# EAGLE schematic TINRS - Looper (EAGLE 7.7.0)

## Sheet 1 of 5: MCU & Eeprom
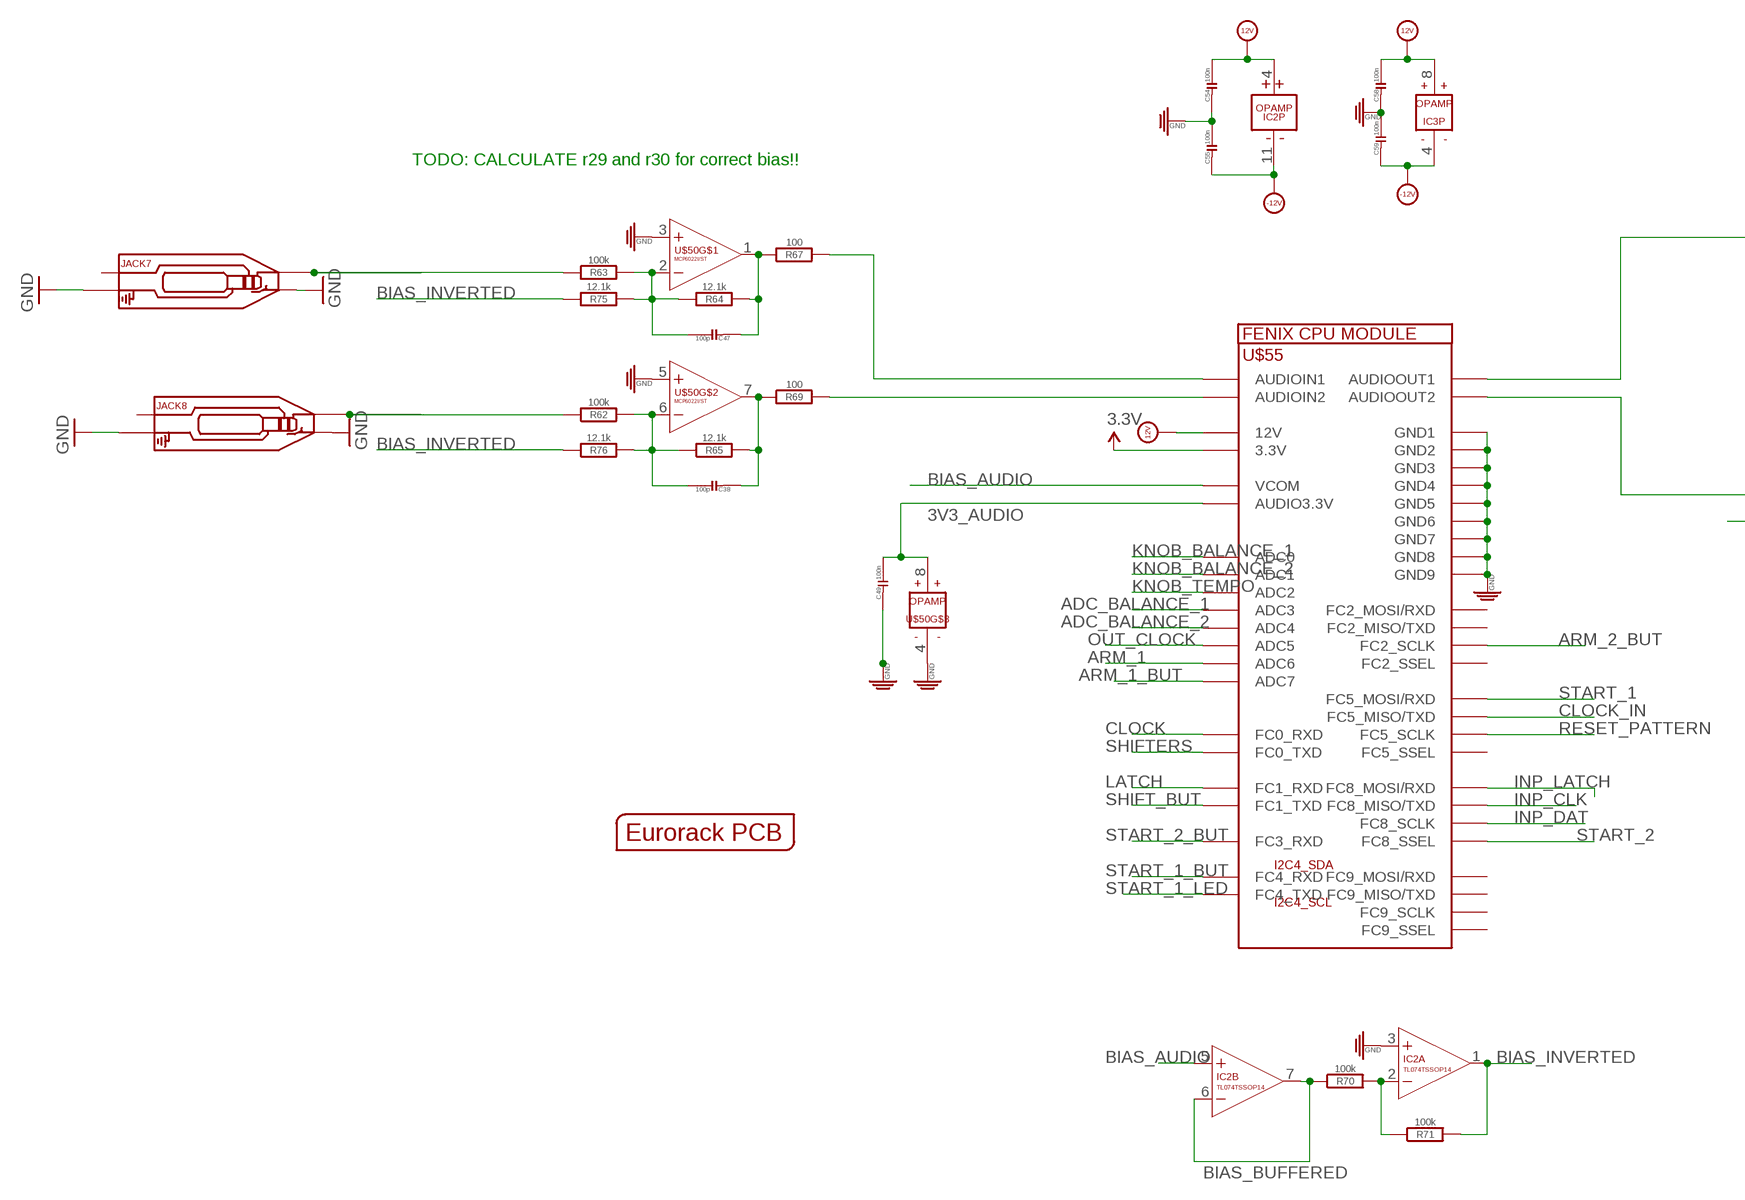
[diagram p0: schematic, sheet 1, part 1 of 2]
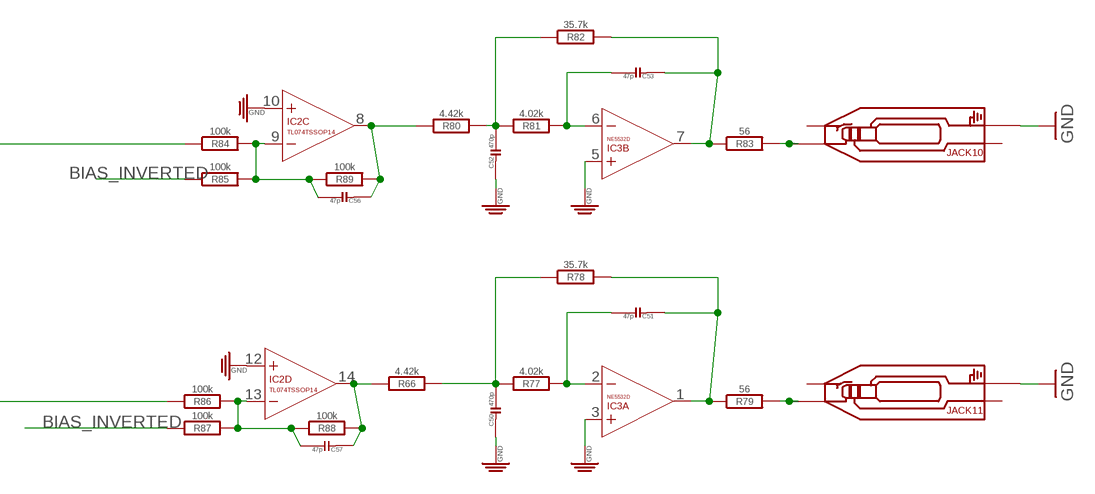
[diagram p1: schematic, sheet 1, part 2 of 2]

### Parts
C38  100p  C-0603  [C0603]
C47  100p  C-0603  [C0603]
C49  100n  C-0603  [C0603]
C50  470p  C-0603  [C0603]
C51  47p  C-0603  [C0603]
C52  470p  C-0603  [C0603]
C53  47p  C-0603  [C0603]
C54  100n  C-0603  [C0603]
C55  100n  C-0603  [C0603]
C56  47p  C-0603  [C0603]
C57  47p  C-0603  [C0603]
C58  100n  C-0603  [C0603]
C59  100n  C-0603  [C0603]
IC2  TL074TSSOP14  [TSSOP14]
IC3  NE5532D  [SO08]
JACK7  AUDIO-JACK_SMALLSYMBOL  [3.5MM-JACK-SWITCH-13MM-NOHOLES-TESTPAD]
JACK8  AUDIO-JACK_SMALLSYMBOL  [3.5MM-JACK-SWITCH-13MM-NOHOLES-TESTPAD]
JACK10  AUDIO-JACK_SMALLSYMBOL  [3.5MM-JACK-SWITCH-13MM-NOHOLES-TESTPAD]
JACK11  AUDIO-JACK_SMALLSYMBOL  [3.5MM-JACK-SWITCH-13MM-NOHOLES-TESTPAD]
OUTLINE  EURORACK_PCB12HP  [EURORACK12HPPCB]
R62  100k  R-EU_R0402  [R0402]
R63  100k  R-EU_R0402  [R0402]
R64  12.1k  R-EU_R0402  [R0402]
R65  12.1k  R-EU_R0402  [R0402]
R66  4.42k  R-EU_R0402  [R0402]
R67  100  R-EU_R0402  [R0402]
R69  100  R-EU_R0402  [R0402]
R70  100k  R-EU_R0402  [R0402]
R71  100k  R-EU_R0402  [R0402]
R75  12.1k  R-EU_R0402  [R0402]
R76  12.1k  R-EU_R0402  [R0402]
R77  4.02k  R-EU_R0402  [R0402]
R78  35.7k  R-EU_R0402  [R0402]
R79  56  R-EU_R0402  [R0402]
R80  4.42k  R-EU_R0402  [R0402]
R81  4.02k  R-EU_R0402  [R0402]
R82  35.7k  R-EU_R0402  [R0402]
R83  56  R-EU_R0402  [R0402]
R84  100k  R-EU_R0402  [R0402]
R85  100k  R-EU_R0402  [R0402]
R86  100k  R-EU_R0402  [R0402]
R87  100k  R-EU_R0402  [R0402]
R88  100k  R-EU_R0402  [R0402]
R89  100k  R-EU_R0402  [R0402]
U$50  MCP6022I/ST  [TSSOP8]
U$55  MCUPLUGIN2  [MCUPLUGIN]

### Nets
3.3V: U$55.P$7(3.3V) ; also sheet 2,4,5
3V3_AUDIO [heavypower]: C49.2 U$50.8(V+) U$55.P$48(AUDIO3.3V)
12V [heavypower]: C54.2 C58.2 IC2.4(P:V+) IC3.8(P:V+) U$55.P$45(12V) ; also sheet 2,4
-12V [heavypower]: C55.1 C59.1 IC2.11(P:V-) IC3.4(P:V-) ; also sheet 4
ADC_BALANCE_1: U$55.P$28(ADC3) ; also sheet 5
ADC_BALANCE_2: U$55.P$29(ADC4) ; also sheet 5
ARM_1: U$55.P$31(ADC6) ; also sheet 5
ARM_1_BUT: U$55.P$32(ADC7) ; also sheet 2
ARM_2_BUT: U$55.P$11(FC2_SCLK) ; also sheet 2
BIAS_AUDIO: IC2.5(B:+IN) U$55.P$47(VCOM)
BIAS_BUFFERED: IC2.6(B:-IN) IC2.7(B:OUT) R70.1
BIAS_INVERTED: IC2.1(A:OUT) R71.2 R75.1 R76.1 R85.1 R87.1
CLOCK: U$55.P$36(FC0_RXD) ; also sheet 2
CLOCK_IN: U$55.P$21(FC5_MISO/TXD) ; also sheet 5
GND: C49.1 C50.1 C52.1 C54.1 C55.2 C58.1 C59.2 IC2.3(A:+IN) IC2.10(C:+IN) IC2.12(D:+IN) IC3.3(A:+IN) IC3.5(B:+IN) JACK7.RING_B@1(RING) JACK7.RING_T@3(RING) JACK7.SWITCH_B@1(SWITCH) JACK7.SWITCH_T@3(SWITCH) JACK8.RING_B@1(RING) JACK8.RING_T@3(RING) JACK8.SWITCH_B@1(SWITCH) JACK8.SWITCH_T@3(SWITCH) JACK10.RING_B@1(RING) JACK10.RING_T@3(RING) JACK11.RING_B@1(RING) JACK11.RING_T@3(RING) U$50.3(+IN) U$50.4(V-) U$50.5(+IN) U$55.P$1(GND1) U$55.P$6(GND2) U$55.P$8(GND3) U$55.P$23(GND4) U$55.P$24(GND5) U$55.P$33(GND6) U$55.P$39(GND7) U$55.P$40(GND8) U$55.P$46(GND9) ; also sheet 2,4,5
INP_CLK: U$55.P$13(FC8_MISO/TXD) ; also sheet 2
INP_DAT: U$55.P$15(FC8_SCLK) ; also sheet 2
INP_LATCH: U$55.P$14(FC8_MOSI/RXD) ; also sheet 2
KNOB_BALANCE_1: U$55.P$25(ADC0) ; also sheet 5
KNOB_BALANCE_2: U$55.P$26(ADC1) ; also sheet 5
KNOB_TEMPO: U$55.P$27(ADC2) ; also sheet 5
LATCH: U$55.P$38(FC1_RXD) ; also sheet 2
N$75: C38.2 R62.2 R65.1 R76.2 U$50.6(-IN)
N$77: C47.2 R63.2 R64.1 R75.2 U$50.2(-IN)
N$78: C38.1 R65.2 R69.1 U$50.7(OUT)
N$79: C47.1 R64.2 R67.1 U$50.1(OUT)
N$83: IC2.2(A:-IN) R70.2 R71.1
N$84: C51.2 IC3.2(A:-IN) R77.2
N$85: C50.2 R66.2 R77.1 R78.1
N$88: C51.1 IC3.1(A:OUT) R78.2 R79.1
N$89: JACK11.TIP_B@1(TIP) JACK11.TIP_T@3(TIP) R79.2
N$90: C53.2 IC3.6(B:-IN) R81.2
N$91: C52.2 R80.2 R81.1 R82.1
N$92: C53.1 IC3.7(B:OUT) R82.2 R83.1
N$94: JACK10.TIP_B@1(TIP) JACK10.TIP_T@3(TIP) R83.2
N$101: C56.2 IC2.9(C:-IN) R84.2 R85.2 R89.1
N$102: C57.2 IC2.13(D:-IN) R86.2 R87.2 R88.1
N$103: C56.1 IC2.8(C:OUT) R80.1 R89.2
N$104: R86.1 U$55.P$44(AUDIOOUT2)
N$105: R84.1 U$55.P$42(AUDIOOUT1)
N$106: C57.1 IC2.14(D:OUT) R66.1 R88.2
N$107: JACK7.TIP_B@1(TIP) JACK7.TIP_T@3(TIP) R63.1
N$108: JACK8.TIP_B@1(TIP) JACK8.TIP_T@3(TIP) R62.1
OUT_CLOCK: U$55.P$30(ADC5) ; also sheet 2
RESET_PATTERN: U$55.P$20(FC5_SCLK) ; also sheet 5
SHIFT_BUT: U$55.P$37(FC1_TXD) ; also sheet 2
SHIFTERS: U$55.P$35(FC0_TXD) ; also sheet 2
START_1: U$55.P$22(FC5_MOSI/RXD) ; also sheet 5
START_1_BUT: U$55.P$18(FC4_RXD) ; also sheet 2
START_1_LED: U$55.P$17(FC4_TXD) ; also sheet 2
START_2: U$55.P$16(FC8_SSEL) ; also sheet 5
START_2_BUT: U$55.P$34(FC3_RXD) ; also sheet 2
TO_AUDIOIN_1: R67.2 U$55.P$41(AUDIOIN1)
TO_AUDIOIN_2: R69.2 U$55.P$43(AUDIOIN2)
Unconnected: JACK7.SECOND_B@1(SECOND) JACK7.SECOND_T@3(SECOND) JACK8.SECOND_B@1(SECOND) JACK8.SECOND_T@3(SECOND) JACK10.SECOND_B@1(SECOND) JACK10.SECOND_T@3(SECOND) JACK10.SWITCH_B@1(SWITCH) JACK10.SWITCH_T@3(SWITCH) JACK11.SECOND_B@1(SECOND) JACK11.SECOND_T@3(SECOND) JACK11.SWITCH_B@1(SWITCH) JACK11.SWITCH_T@3(SWITCH) U$55.P$2(FC9_MOSI/RXD) U$55.P$3(FC9_MISO/TXD) U$55.P$4(FC9_SCLK) U$55.P$5(FC9_SSEL) U$55.P$9(FC2_MOSI/RXD) U$55.P$10(FC2_MISO/TXD) U$55.P$12(FC2_SSEL) U$55.P$19(FC5_SSEL)

### Notes on the sheet
- TODO: CALCULATE r29 and r30 for correct bias!!

## Sheet 2 of 5: LEDs & button
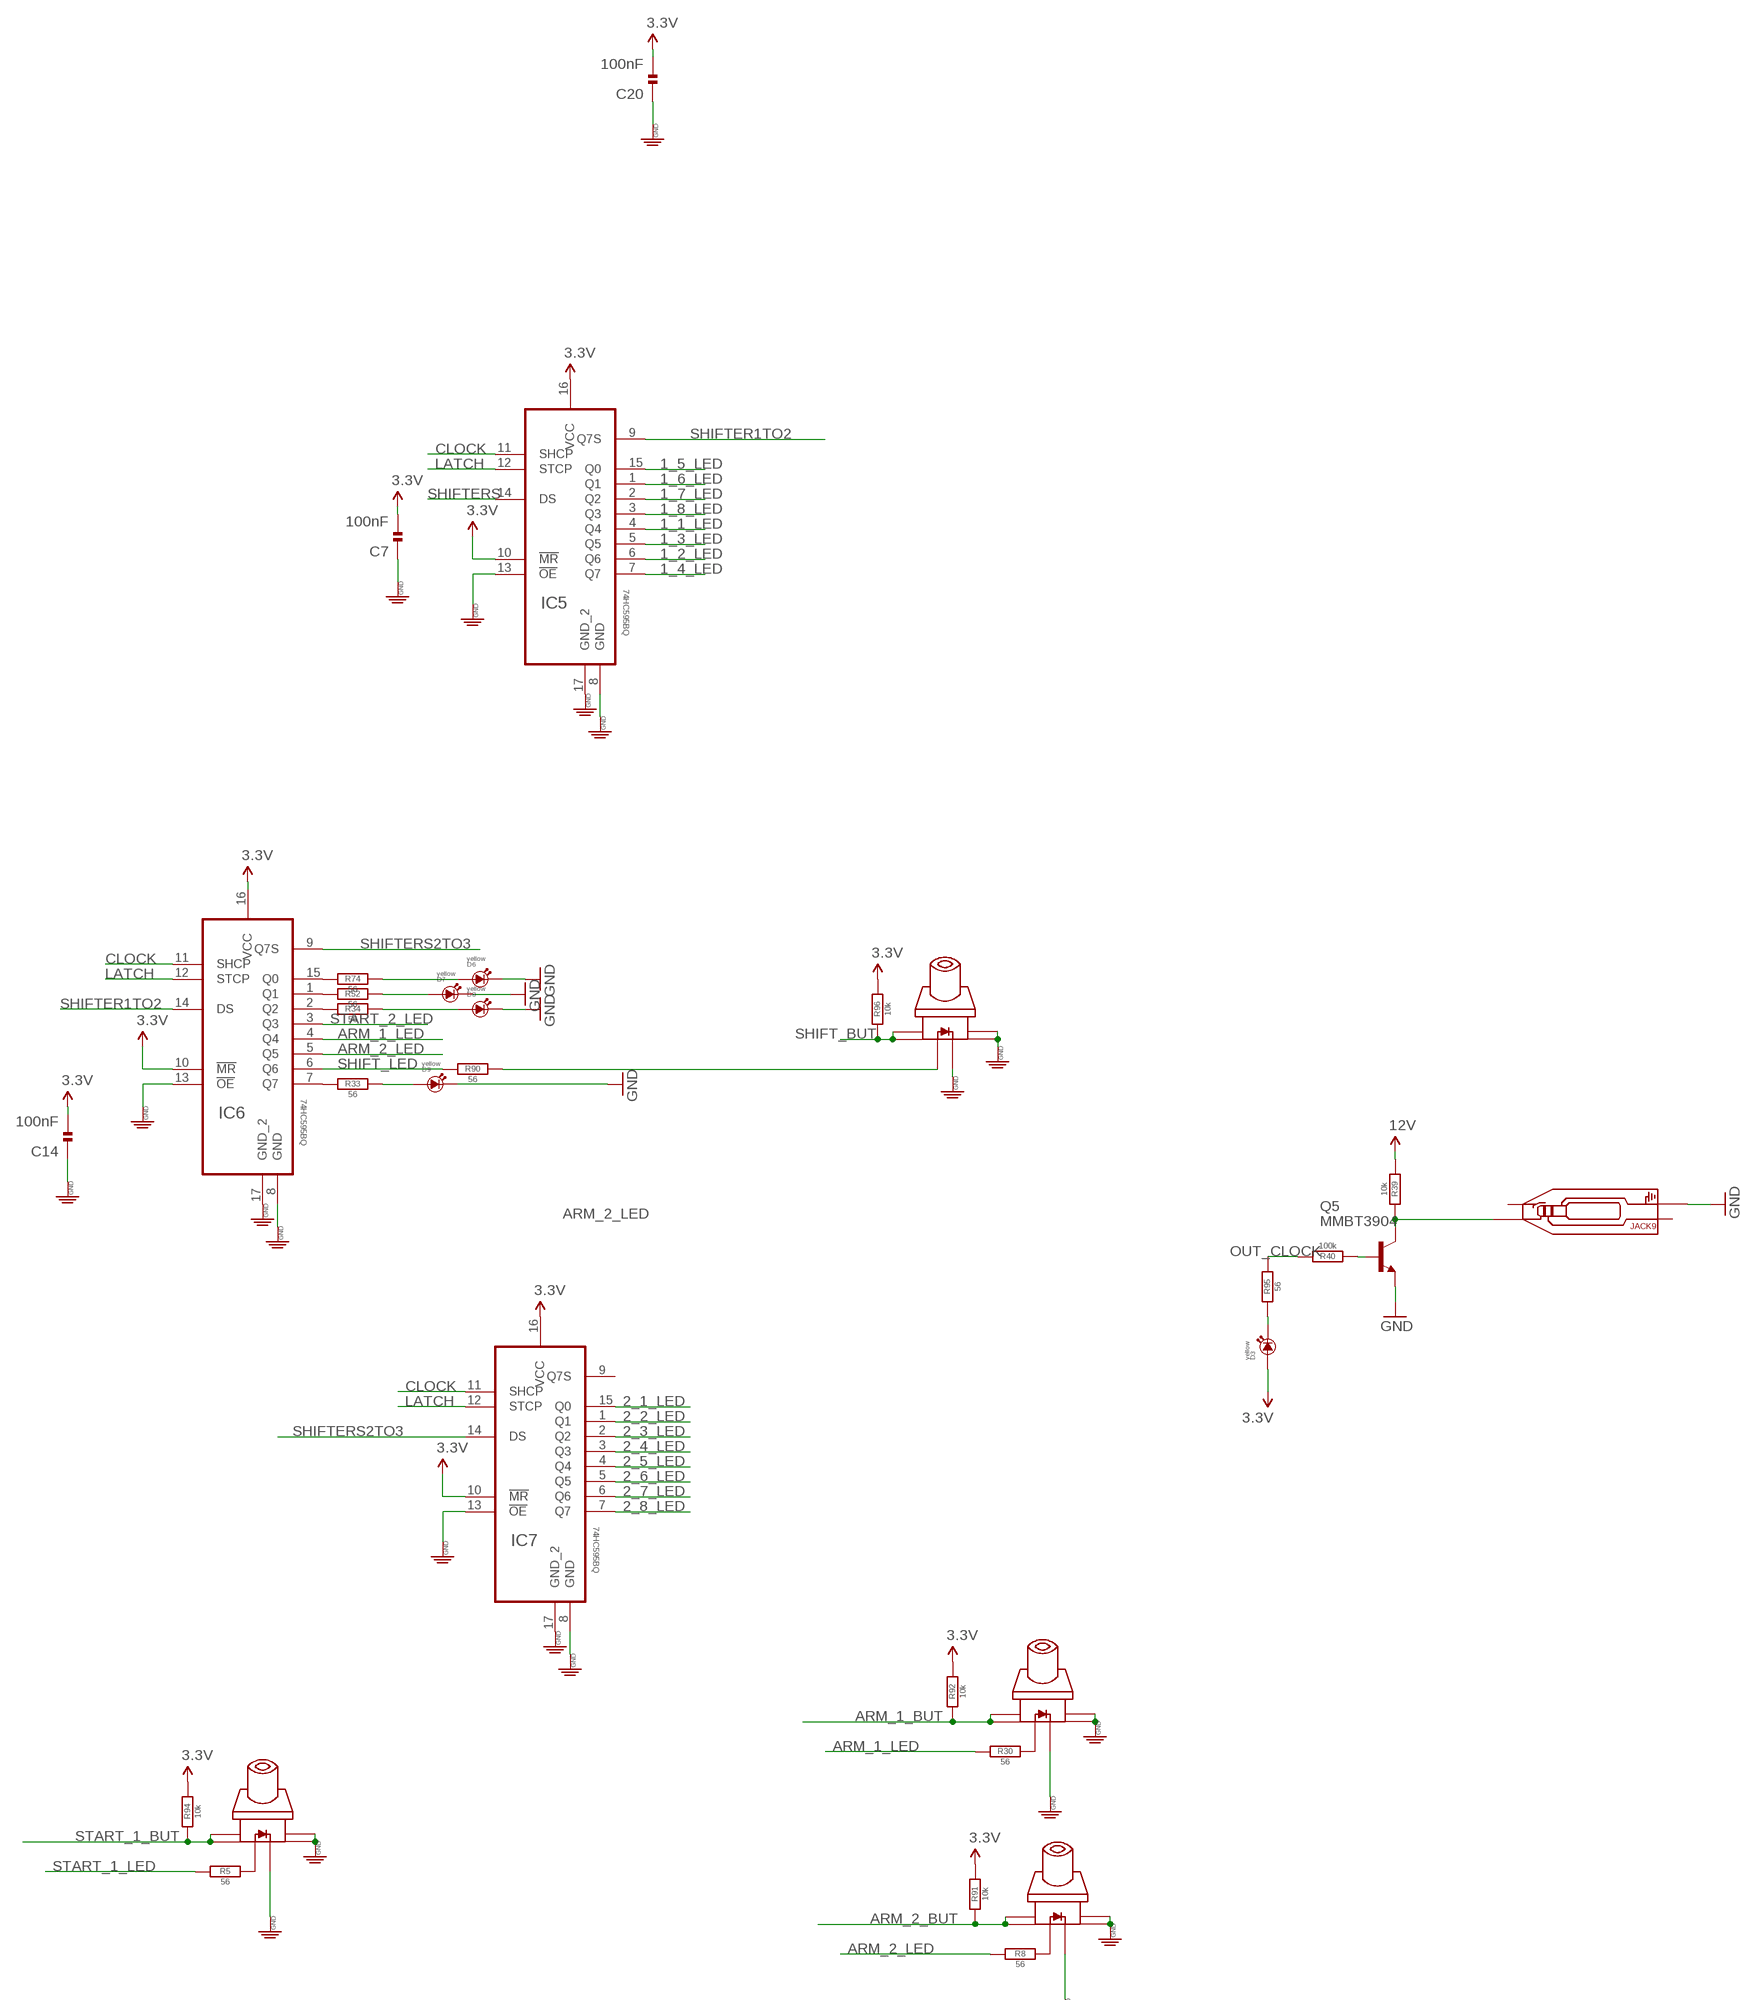
[diagram p2: schematic, sheet 2, part 1 of 3]
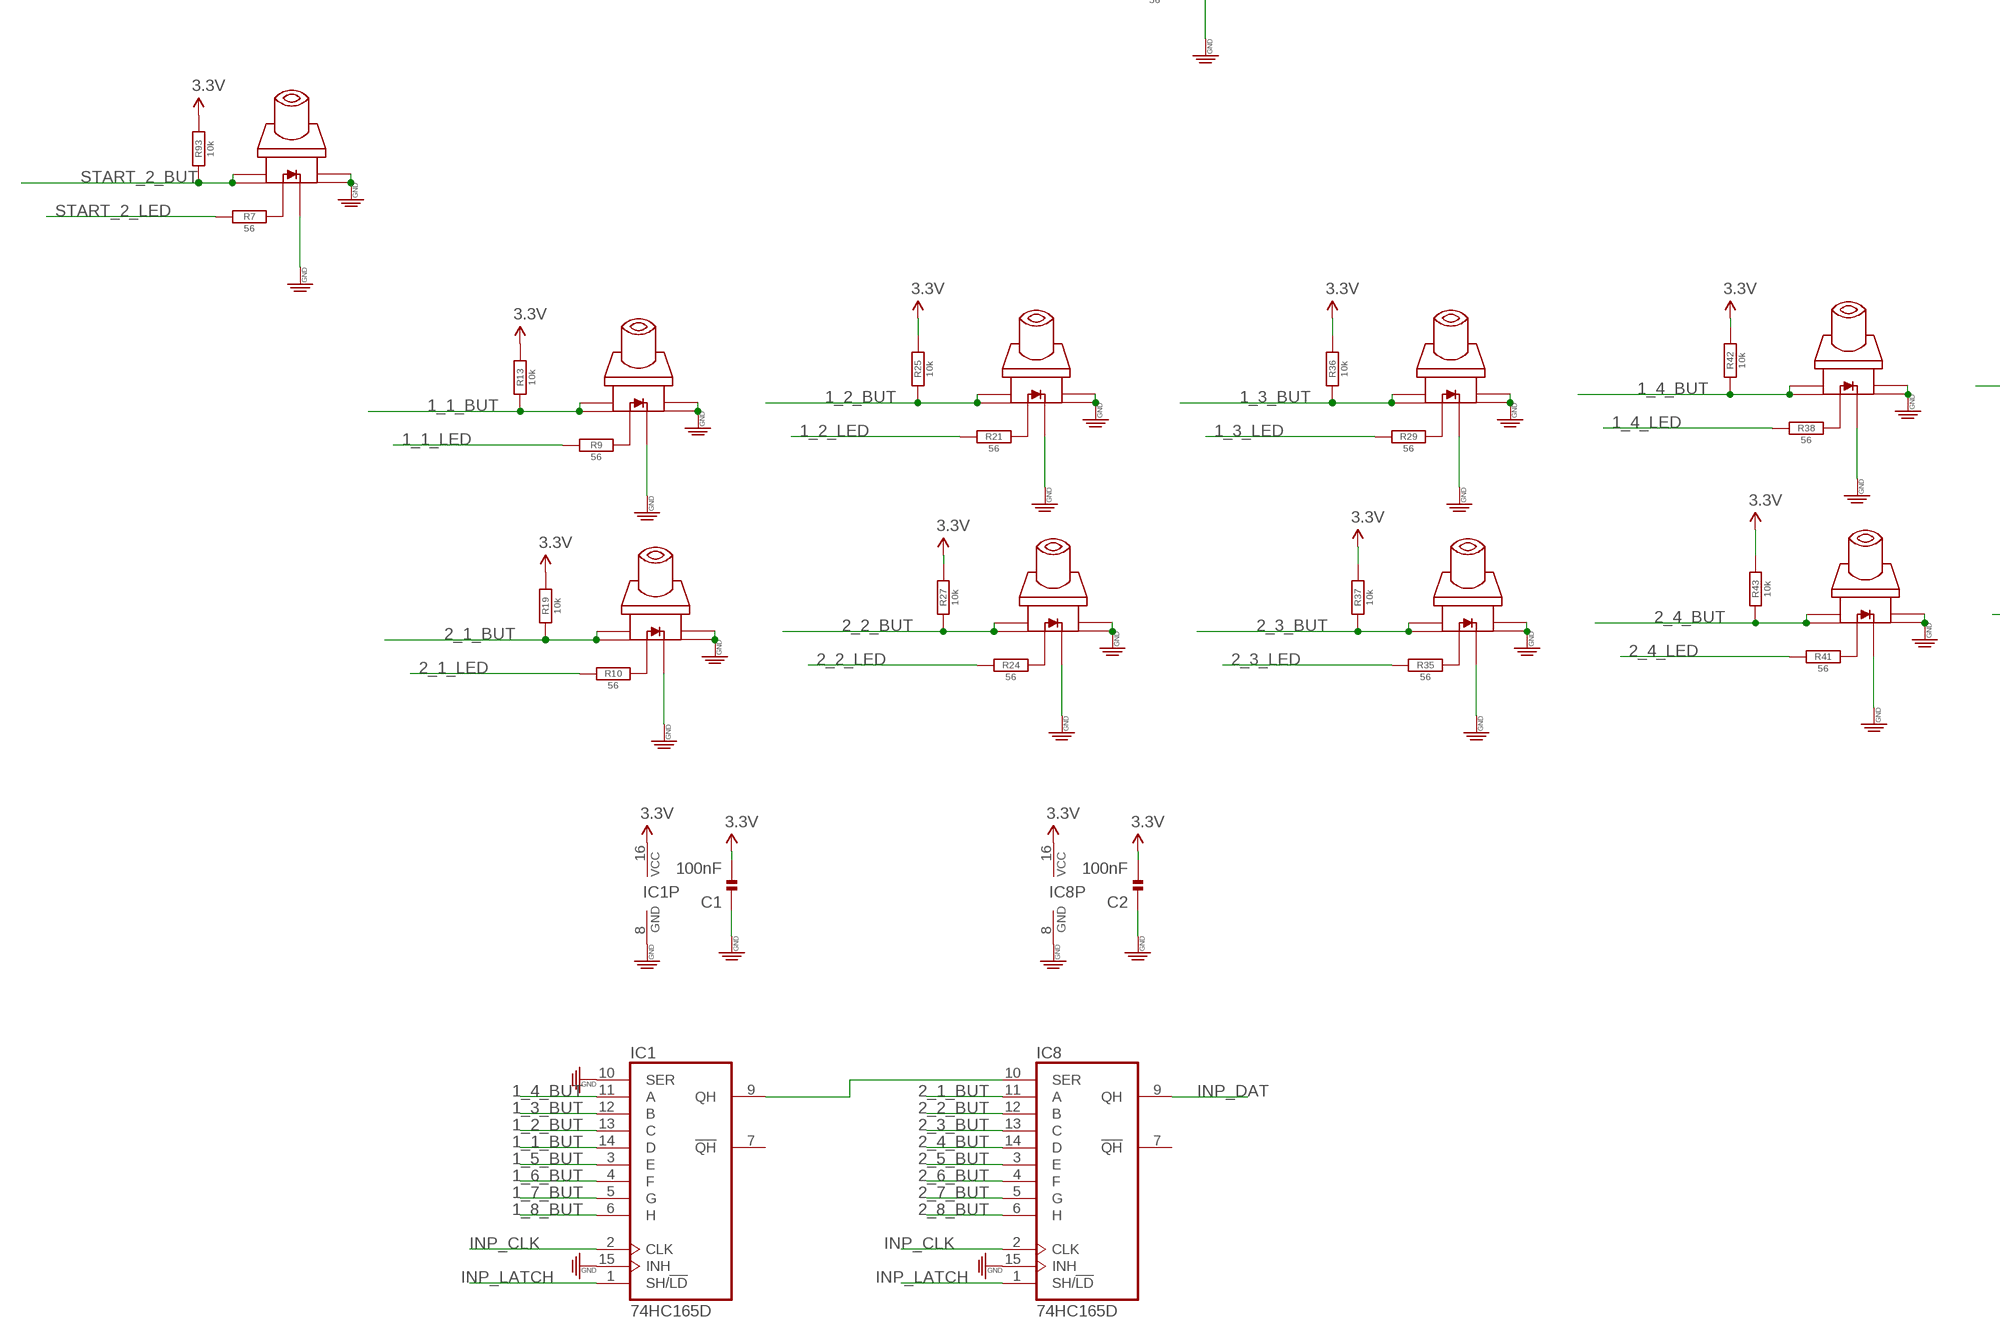
[diagram p3: schematic, sheet 2, part 2 of 3]
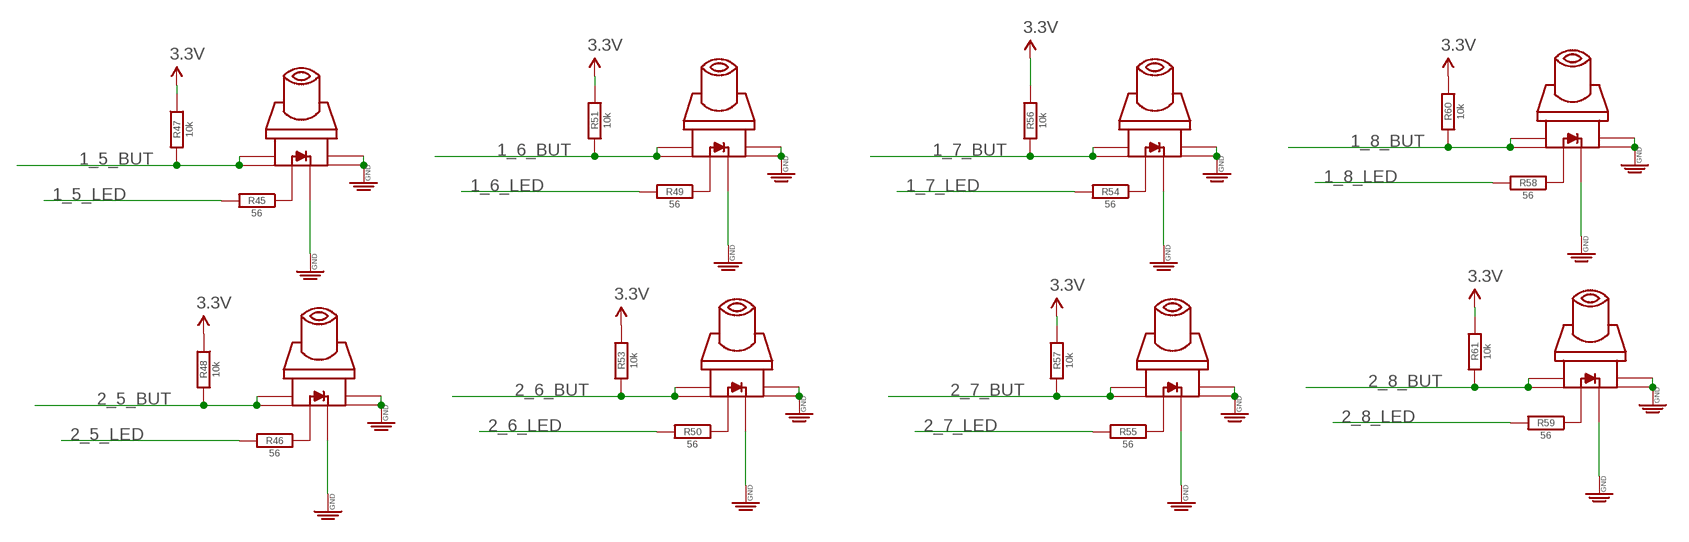
[diagram p4: schematic, sheet 2, part 3 of 3]

### Parts
C1  100nF  C-EUC0402  [C0402]
C2  100nF  C-EUC0402  [C0402]
C7  100nF  C-EUC0402  [C0402]
C14  100nF  C-EUC0402  [C0402]
C20  100nF  C-EUC0402  [C0402]
D3  yellow  LED3MM  [3MMLED]
D6  yellow  LED3MM  [3MMLED]
D7  yellow  LED3MM  [3MMLED]
D8  yellow  LED3MM  [3MMLED]
D9  yellow  LED3MM  [3MMLED]
IC1  74HC165D  [SO16]
IC5  74HC595BQ  [QFN50P250X350X100-17N]
IC6  74HC595BQ  [QFN50P250X350X100-17N]
IC7  74HC595BQ  [QFN50P250X350X100-17N]
IC8  74HC165D  [SO16]
JACK9  AUDIO-JACK_SMALLSYMBOL  [3.5MM-JACK-SWITCH-13MM-NOHOLES-TESTPAD]
Q5  MMBT3904  MMBT3904LT1-NPN-SOT23-BEC  [SOT23-BEC]
R5  56  R-EU_R0402  [R0402]
R7  56  R-EU_R0402  [R0402]
R8  56  R-EU_R0402  [R0402]
R9  56  R-EU_R0402  [R0402]
R10  56  R-EU_R0402  [R0402]
R13  10k  R-EU_R0402  [R0402]
R19  10k  R-EU_R0402  [R0402]
R21  56  R-EU_R0402  [R0402]
R24  56  R-EU_R0402  [R0402]
R25  10k  R-EU_R0402  [R0402]
R27  10k  R-EU_R0402  [R0402]
R29  56  R-EU_R0402  [R0402]
R30  56  R-EU_R0402  [R0402]
R33  56  R-EU_R0402  [R0402]
R34  56  R-EU_R0402  [R0402]
R35  56  R-EU_R0402  [R0402]
R36  10k  R-EU_R0402  [R0402]
R37  10k  R-EU_R0402  [R0402]
R38  56  R-EU_R0402  [R0402]
R39  10k  R-EU_R0402  [R0402]
R40  100k  R-EU_R0402  [R0402]
R41  56  R-EU_R0402  [R0402]
R42  10k  R-EU_R0402  [R0402]
R43  10k  R-EU_R0402  [R0402]
R45  56  R-EU_R0402  [R0402]
R46  56  R-EU_R0402  [R0402]
R47  10k  R-EU_R0402  [R0402]
R48  10k  R-EU_R0402  [R0402]
R49  56  R-EU_R0402  [R0402]
R50  56  R-EU_R0402  [R0402]
R51  10k  R-EU_R0402  [R0402]
R52  56  R-EU_R0402  [R0402]
R53  10k  R-EU_R0402  [R0402]
R54  56  R-EU_R0402  [R0402]
R55  56  R-EU_R0402  [R0402]
R56  10k  R-EU_R0402  [R0402]
R57  10k  R-EU_R0402  [R0402]
R58  56  R-EU_R0402  [R0402]
R59  56  R-EU_R0402  [R0402]
R60  10k  R-EU_R0402  [R0402]
R61  10k  R-EU_R0402  [R0402]
R74  56  R-EU_R0402  [R0402]
R90  56  R-EU_R0402  [R0402]
R91  10k  R-EU_R0402  [R0402]
R92  10k  R-EU_R0402  [R0402]
R93  10k  R-EU_R0402  [R0402]
R94  10k  R-EU_R0402  [R0402]
R95  56  R-EU_R0402  [R0402]
R96  10k  R-EU_R0402  [R0402]
U$1  SWITCH_W_LED_PB6149L-X-102YELLOW  [PB6149L]
U$11  SWITCH_W_LED_PB6149L-X-102YELLOW  [PB6149L]
U$12  SWITCH_W_LED_PB6149L-X-102YELLOW  [PB6149L]
U$13  SWITCH_W_LED_PB6149L-X-102YELLOW  [PB6149L]
U$23  SWITCH_W_LED_PB6149L-X-102YELLOW  [PB6149L]
U$24  SWITCH_W_LED_PB6149L-X-102YELLOW  [PB6149L]
U$28  SWITCH_W_LED_PB6149L-X-102YELLOW  [PB6149L]
U$31  SWITCH_W_LED_PB6149L-X-102YELLOW  [PB6149L]
U$32  SWITCH_W_LED_PB6149L-X-102YELLOW  [PB6149L]
U$33  SWITCH_W_LED_PB6149L-X-102YELLOW  [PB6149L]
U$34  SWITCH_W_LED_PB6149L-X-102YELLOW  [PB6149L]
U$35  SWITCH_W_LED_PB6149L-X-102YELLOW  [PB6149L]
U$36  SWITCH_W_LED_PB6149L-X-102YELLOW  [PB6149L]
U$37  SWITCH_W_LED_PB6149L-X-102YELLOW  [PB6149L]
U$38  SWITCH_W_LED_PB6149L-X-102YELLOW  [PB6149L]
U$39  SWITCH_W_LED_PB6149L-X-102YELLOW  [PB6149L]
U$40  SWITCH_W_LED_PB6149L-X-102YELLOW  [PB6149L]
U$41  SWITCH_W_LED_PB6149L-X-102YELLOW  [PB6149L]
U$42  SWITCH_W_LED_PB6149L-X-102YELLOW  [PB6149L]
U$43  SWITCH_W_LED_PB6149L-X-102YELLOW  [PB6149L]
U$44  SWITCH_W_LED_PB6149L-X-102YELLOW  [PB6149L]

### Nets
1_1_BUT: IC1.14(D) R13.2 U$23.1 U$23.2
1_1_LED: IC5.4(Q4) R9.2
1_2_BUT: IC1.13(C) R25.2 U$31.1 U$31.2
1_2_LED: IC5.6(Q6) R21.2
1_3_BUT: IC1.12(B) R36.2 U$33.1 U$33.2
1_3_LED: IC5.5(Q5) R29.2
1_4_BUT: IC1.11(A) R42.2 U$35.1 U$35.2
1_4_LED: IC5.7(Q7) R38.2
1_5_BUT: IC1.3(E) R47.2 U$37.1 U$37.2
1_5_LED: IC5.15(Q0) R45.2
1_6_BUT: IC1.4(F) R51.2 U$39.1 U$39.2
1_6_LED: IC5.1(Q1) R49.2
1_7_BUT: IC1.5(G) R56.2 U$41.1 U$41.2
1_7_LED: IC5.2(Q2) R54.2
1_8_BUT: IC1.6(H) R60.2 U$43.1 U$43.2
1_8_LED: IC5.3(Q3) R58.2
2_1_BUT: IC8.11(A) R19.2 U$24.1 U$24.2
2_1_LED: IC7.15(Q0) R10.2
2_2_BUT: IC8.12(B) R27.2 U$32.1 U$32.2
2_2_LED: IC7.1(Q1) R24.2
2_3_BUT: IC8.13(C) R37.2 U$34.1 U$34.2
2_3_LED: IC7.2(Q2) R35.2
2_4_BUT: IC8.14(D) R43.2 U$36.1 U$36.2
2_4_LED: IC7.3(Q3) R41.2
2_5_BUT: IC8.3(E) R48.2 U$38.1 U$38.2
2_5_LED: IC7.4(Q4) R46.2
2_6_BUT: IC8.4(F) R53.2 U$40.1 U$40.2
2_6_LED: IC7.5(Q5) R50.2
2_7_BUT: IC8.5(G) R57.2 U$42.1 U$42.2
2_7_LED: IC7.6(Q6) R55.2
2_8_BUT: IC8.6(H) R61.2 U$44.1 U$44.2
2_8_LED: IC7.7(Q7) R59.2
3.3V: C1.2 C2.2 C7.2 C14.2 C20.2 D3.+ IC1.16(VCC) IC5.10(!MR) IC5.16(VCC) IC6.10(!MR) IC6.16(VCC) IC7.10(!MR) IC7.16(VCC) IC8.16(VCC) R13.1 R19.1 R25.1 R27.1 R36.1 R37.1 R42.1 R43.1 R47.1 R48.1 R51.1 R53.1 R56.1 R57.1 R60.1 R61.1 R91.1 R92.1 R93.1 R94.1 R96.1 ; also sheet 1,4,5
12V [heavypower]: R39.2 ; also sheet 1,4
ARM_1_BUT: R92.2 U$28.1 U$28.2 ; also sheet 1
ARM_1_LED: IC6.4(Q4) R30.2
ARM_2_BUT: R91.2 U$13.1 U$13.2 ; also sheet 1
ARM_2_LED: IC6.5(Q5) R8.2
CLOCK: IC5.11(SHCP) IC6.11(SHCP) IC7.11(SHCP) ; also sheet 1
GND: C1.1 C2.1 C7.1 C14.1 C20.1 D6.- D7.- D8.- D9.- IC1.8(GND) IC1.10(SER) IC1.15(INH) IC5.8(GND) IC5.13(!OE) IC5.17(GND_2) IC6.8(GND) IC6.13(!OE) IC6.17(GND_2) IC7.8(GND) IC7.13(!OE) IC7.17(GND_2) IC8.8(GND) IC8.15(INH) JACK9.RING_B@1(RING) JACK9.RING_T@3(RING) Q5.E U$1.3 U$1.4 U$1.LEDNEG(NEG) U$11.3 U$11.4 U$11.LEDNEG(NEG) U$12.3 U$12.4 U$12.LEDNEG(NEG) U$13.3 U$13.4 U$13.LEDNEG(NEG) U$23.3 U$23.4 U$23.LEDNEG(NEG) U$24.3 U$24.4 U$24.LEDNEG(NEG) U$28.3 U$28.4 U$28.LEDNEG(NEG) U$31.3 U$31.4 U$31.LEDNEG(NEG) U$32.3 U$32.4 U$32.LEDNEG(NEG) U$33.3 U$33.4 U$33.LEDNEG(NEG) U$34.3 U$34.4 U$34.LEDNEG(NEG) U$35.3 U$35.4 U$35.LEDNEG(NEG) U$36.3 U$36.4 U$36.LEDNEG(NEG) U$37.3 U$37.4 U$37.LEDNEG(NEG) U$38.3 U$38.4 U$38.LEDNEG(NEG) U$39.3 U$39.4 U$39.LEDNEG(NEG) U$40.3 U$40.4 U$40.LEDNEG(NEG) U$41.3 U$41.4 U$41.LEDNEG(NEG) U$42.3 U$42.4 U$42.LEDNEG(NEG) U$43.3 U$43.4 U$43.LEDNEG(NEG) U$44.3 U$44.4 U$44.LEDNEG(NEG) ; also sheet 1,4,5
INP_CLK: IC1.2(CLK) IC8.2(CLK) ; also sheet 1
INP_DAT: IC8.9(QH) ; also sheet 1
INP_LATCH: IC1.1(SH/!LD) IC8.1(SH/!LD) ; also sheet 1
LATCH: IC5.12(STCP) IC6.12(STCP) IC7.12(STCP) ; also sheet 1
N$5: R5.1 U$11.LEDPOS(POS)
N$7: R7.1 U$12.LEDPOS(POS)
N$9: R8.1 U$13.LEDPOS(POS)
N$10: R9.1 U$23.LEDPOS(POS)
N$14: D7.+ R52.1
N$18: IC1.9(QH) IC8.10(SER)
N$20: R10.1 U$24.LEDPOS(POS)
N$21: R21.1 U$31.LEDPOS(POS)
N$23: R24.1 U$32.LEDPOS(POS)
N$24: IC6.7(Q7) R33.2
N$25: R29.1 U$33.LEDPOS(POS)
N$27: D3.- R95.2
N$28: R35.1 U$34.LEDPOS(POS)
N$29: R38.1 U$35.LEDPOS(POS)
N$32: R41.1 U$36.LEDPOS(POS)
N$37: R45.1 U$37.LEDPOS(POS)
N$38: IC6.2(Q2) R34.2
N$39: IC6.1(Q1) R52.2
N$40: IC6.15(Q0) R74.2
N$42: R46.1 U$38.LEDPOS(POS)
N$46: D6.+ R74.1
N$49: D8.+ R34.1
N$50: D9.+ R33.1
N$51: R49.1 U$39.LEDPOS(POS)
N$57: R50.1 U$40.LEDPOS(POS)
N$58: R54.1 U$41.LEDPOS(POS)
N$59: R55.1 U$42.LEDPOS(POS)
N$60: Q5.B R40.2
N$61: JACK9.TIP_B@1(TIP) JACK9.TIP_T@3(TIP) Q5.C R39.1
N$62: R58.1 U$43.LEDPOS(POS)
N$63: R59.1 U$44.LEDPOS(POS)
N$71: R30.1 U$28.LEDPOS(POS)
OUT_CLOCK: R40.1 R95.1 ; also sheet 1
SHIFT_BUT: R96.2 U$1.1 U$1.2 ; also sheet 1
SHIFT_LED: IC6.6(Q6) R90.2
SHIFT_LED_L: R90.1 U$1.LEDPOS(POS)
SHIFTER1TO2: IC5.9(Q7S) IC6.14(DS)
SHIFTERS: IC5.14(DS) ; also sheet 1
SHIFTERS2TO3: IC6.9(Q7S) IC7.14(DS)
START_1_BUT: R94.2 U$11.1 U$11.2 ; also sheet 1
START_1_LED: R5.2 ; also sheet 1
START_2_BUT: R93.2 U$12.1 U$12.2 ; also sheet 1
START_2_LED: IC6.3(Q3) R7.2
Unconnected: IC1.7(!QH) IC7.9(Q7S) IC8.7(!QH) JACK9.SECOND_B@1(SECOND) JACK9.SECOND_T@3(SECOND) JACK9.SWITCH_B@1(SWITCH) JACK9.SWITCH_T@3(SWITCH)

## Sheet 3 of 5: DAC & Trigger outs

## Sheet 4 of 5: Power
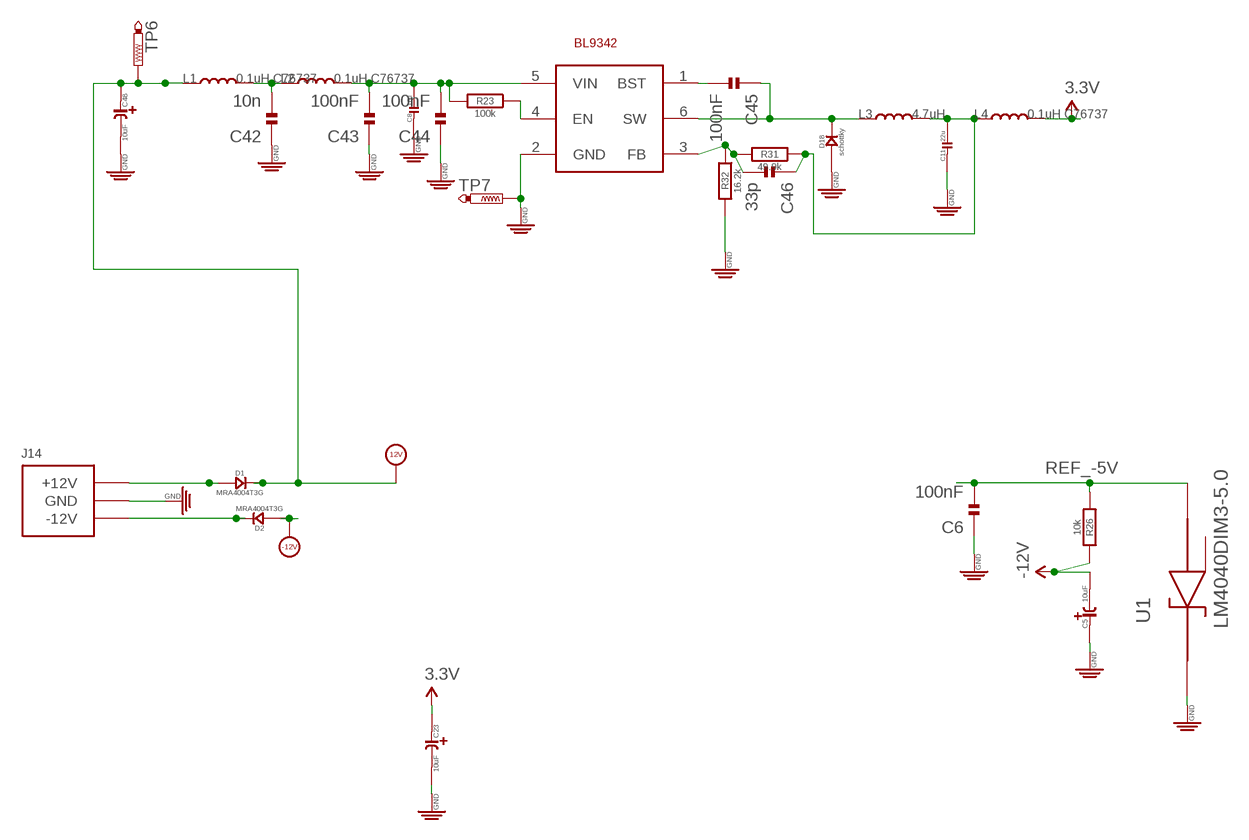
[diagram p5: schematic, sheet 4]

### Parts
C5  10uF  C-POLAR-A  [CASE-A_3216]
C6  100nF  C-EUC0402  [C0402]
C8  10u  C-0805  [C0805]
C11  22u  C-0805  [C0805]
C23  10uF  C-POLAR-A  [CASE-A_3216]
C42  10n  C-EUC0402  [C0402]
C43  100nF  C-EUC0402  [C0402]
C44  100nF  C-EUC0402  [C0402]
C45  100nF  C-EUC0402  [C0402]
C46  33p  C-EUC0402  [C0402]
C48  10uF  C-POLAR-A  [CASE-A_3216]
D1  MRA4004T3G  D-SMA  [DO-214AC]
D2  MRA4004T3G  D-SMA  [DO-214AC]
D18  schottky  D-SOD-123  [SOD123]
J14  POWER_SIMPLE10  [POWER_10]
L1  0.1uH C76737  L-0805  [L0805]
L2  0.1uH C76737  L-0805  [L0805]
L3  4.7uH  L-SPD3D16-4R7M  [L0420]
L4  0.1uH C76737  L-0805  [L0805]
R23  100k  R-EU_R0402  [R0402]
R26  10k  R-EU_R0402  [R0402]
R31  49.9k  R-EU_R0402  [R0402]
R32  16.2k  R-EU_R0402  [R0402]
TP6  PTR1B1,27  [B1,27]
TP7  PTR1B1,27  [B1,27]
U1  LM4040DIM3-5.0  [SOT95P237X112-3N]
U$5  BL9342  [SOT23-6]

### Nets
3.3V: C23.+ L4.2 ; also sheet 1,2,5
12V [heavypower]: C48.+ D1.2(-) L1.1 TP6.TP ; also sheet 1,2
-12V [heavypower]: C5.- D2.1(+) R26.1 ; also sheet 1
GND: C5.+ C6.1 C8.1 C11.1 C23.- C42.1 C43.1 C44.1 C48.- D18.+ J14.3(GND) J14.4(GND) J14.5(GND) J14.6(GND) J14.7(GND) J14.8(GND) R32.2 TP7.TP U1.1(CATHODE) U$5.2(GND) ; also sheet 1,2,5
N$13 [reallyheav]: D1.1(+) J14.9(+12V) J14.10(+12V)
N$64 [reallyheav]: D2.2(-) J14.1(-12V) J14.2(-12V)
N$70 [heavypower]: C42.2 L1.2 L2.1
N$93 [heavypower]: C8.2 C43.2 C44.2 L2.2 R23.2 U$5.5(VIN)
N$95: C45.2 U$5.1(BST)
N$96 [heavypower]: C45.1 D18.- L3.1 U$5.6(SW)
N$97: C46.2 R31.2 R32.1 U$5.3(FB)
N$98: C11.2 C46.1 L3.2 L4.1 R31.1
N$99 [heavypower]: R23.1 U$5.4(EN)
REF_-5V [heavypower]: C6.2 R26.2 U1.2(ANODE) ; also sheet 5
Unconnected: U1.3(NC)

## Sheet 5 of 5: Inputs & Knobs
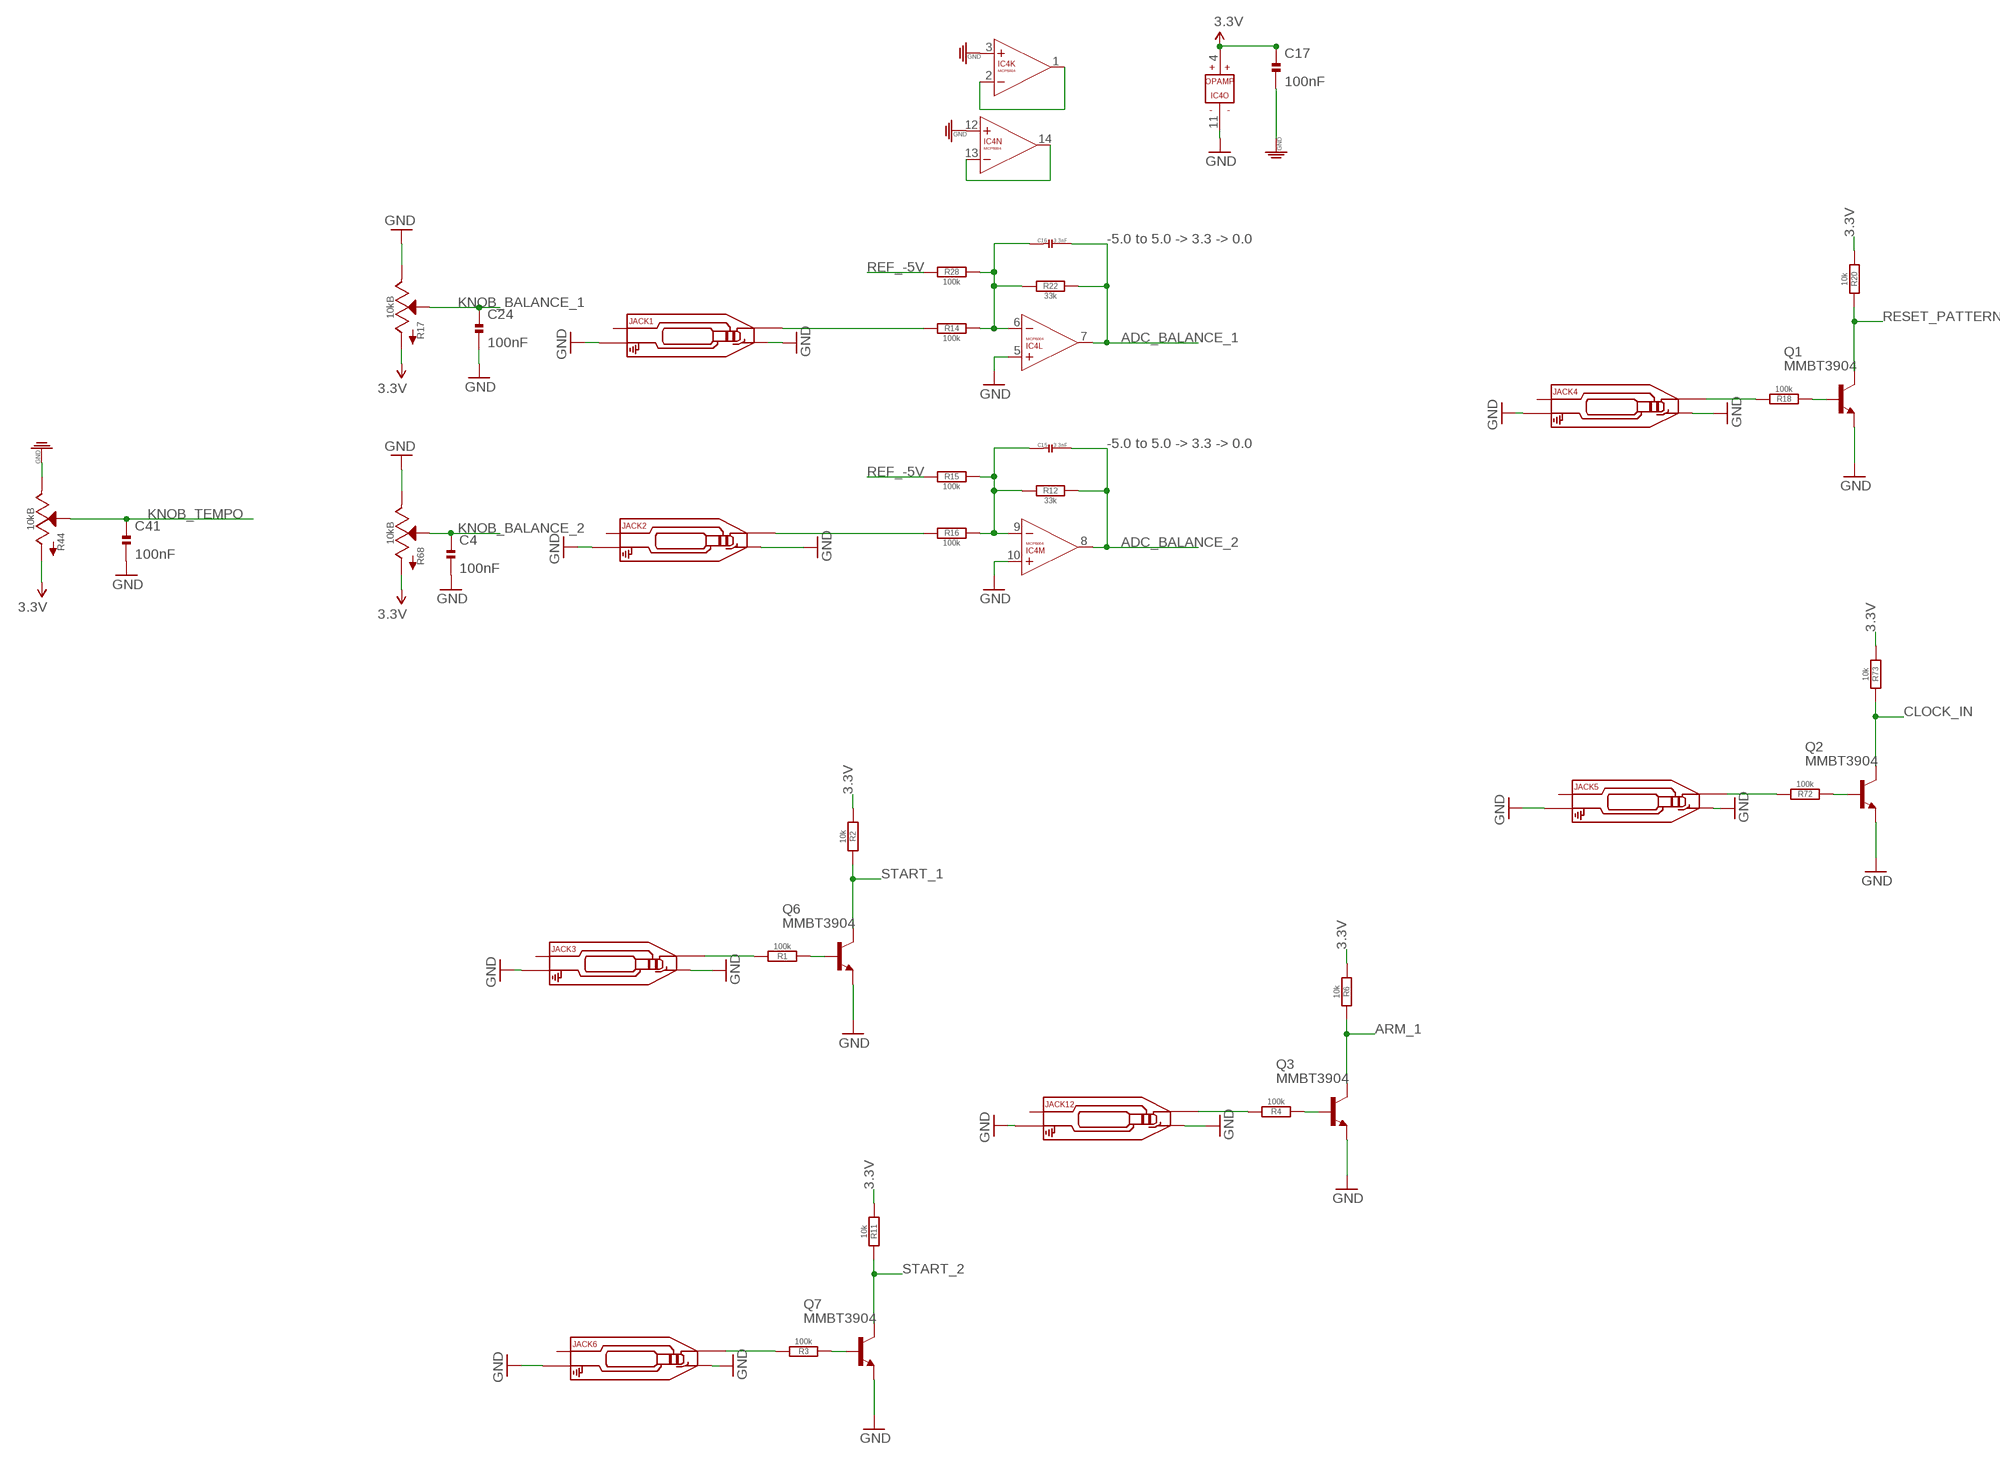
[diagram p6: schematic, sheet 5]

### Parts
C4  100nF  C-EUC0402  [C0402]
C15  3.3nF  C-0603  [C0603]
C16  3.3nF  C-0603  [C0603]
C17  100nF  C-EUC0402  [C0402]
C24  100nF  C-EUC0402  [C0402]
C41  100nF  C-EUC0402  [C0402]
IC4  MCP6004  [SO14]
JACK1  AUDIO-JACK_SMALLSYMBOL  [3.5MM-JACK-SWITCH-13MM-NOHOLES-TESTPAD]
JACK2  AUDIO-JACK_SMALLSYMBOL  [3.5MM-JACK-SWITCH-13MM-NOHOLES-TESTPAD]
JACK3  AUDIO-JACK_SMALLSYMBOL  [3.5MM-JACK-SWITCH-13MM-NOHOLES-TESTPAD]
JACK4  AUDIO-JACK_SMALLSYMBOL  [3.5MM-JACK-SWITCH-13MM-NOHOLES-TESTPAD]
JACK5  AUDIO-JACK_SMALLSYMBOL  [3.5MM-JACK-SWITCH-13MM-NOHOLES-TESTPAD]
JACK6  AUDIO-JACK_SMALLSYMBOL  [3.5MM-JACK-SWITCH-13MM-NOHOLES-TESTPAD]
JACK12  AUDIO-JACK_SMALLSYMBOL  [3.5MM-JACK-SWITCH-13MM-NOHOLES-TESTPAD]
Q1  MMBT3904  MMBT3904LT1-NPN-SOT23-BEC  [SOT23-BEC]
Q2  MMBT3904  MMBT3904LT1-NPN-SOT23-BEC  [SOT23-BEC]
Q3  MMBT3904  MMBT3904LT1-NPN-SOT23-BEC  [SOT23-BEC]
Q6  MMBT3904  MMBT3904LT1-NPN-SOT23-BEC  [SOT23-BEC]
Q7  MMBT3904  MMBT3904LT1-NPN-SOT23-BEC  [SOT23-BEC]
R1  100k  R-EU_R0402  [R0402]
R2  10k  R-EU_R0402  [R0402]
R3  100k  R-EU_R0402  [R0402]
R4  100k  R-EU_R0402  [R0402]
R6  10k  R-EU_R0402  [R0402]
R11  10k  R-EU_R0402  [R0402]
R12  33k  R-EU_R0402  [R0402]
R14  100k  R-EU_R0402  [R0402]
R15  100k  R-EU_R0402  [R0402]
R16  100k  R-EU_R0402  [R0402]
R17  10kB  POTSQUAREHOLE_SMALLKNOB  [ALPS_POT_SQUAREHOLES]
R18  100k  R-EU_R0402  [R0402]
R20  10k  R-EU_R0402  [R0402]
R22  33k  R-EU_R0402  [R0402]
R28  100k  R-EU_R0402  [R0402]
R44  10kB  POTSQUAREHOLE_SMALLKNOB  [ALPS_POT_SQUAREHOLES]
R68  10kB  POTSQUAREHOLE_SMALLKNOB  [ALPS_POT_SQUAREHOLES]
R72  100k  R-EU_R0402  [R0402]
R73  10k  R-EU_R0402  [R0402]

### Nets
3.3V: C17.1 IC4.4(O:V+) R2.2 R6.2 R11.2 R17.P$3(A) R20.2 R44.P$3(A) R68.P$3(A) R73.2 ; also sheet 1,2,4
ADC_BALANCE_1: C16.2 IC4.7(L:OUT) R22.1 ; also sheet 1
ADC_BALANCE_2: C15.2 IC4.8(M:OUT) R12.1 ; also sheet 1
ARM_1: Q3.C R6.1 ; also sheet 1
CLOCK_IN: Q2.C R73.1 ; also sheet 1
GND: C4.2 C17.2 C24.2 C41.2 IC4.3(K:+IN) IC4.5(L:+IN) IC4.10(M:+IN) IC4.11(O:V-) IC4.12(N:+IN) JACK1.RING_B@1(RING) JACK1.RING_T@3(RING) JACK1.SWITCH_B@1(SWITCH) JACK1.SWITCH_T@3(SWITCH) JACK2.RING_B@1(RING) JACK2.RING_T@3(RING) JACK2.SWITCH_B@1(SWITCH) JACK2.SWITCH_T@3(SWITCH) JACK3.RING_B@1(RING) JACK3.RING_T@3(RING) JACK3.SWITCH_B@1(SWITCH) JACK3.SWITCH_T@3(SWITCH) JACK4.RING_B@1(RING) JACK4.RING_T@3(RING) JACK4.SWITCH_B@1(SWITCH) JACK4.SWITCH_T@3(SWITCH) JACK5.RING_B@1(RING) JACK5.RING_T@3(RING) JACK5.SWITCH_B@1(SWITCH) JACK5.SWITCH_T@3(SWITCH) JACK6.RING_B@1(RING) JACK6.RING_T@3(RING) JACK6.SWITCH_B@1(SWITCH) JACK6.SWITCH_T@3(SWITCH) JACK12.RING_B@1(RING) JACK12.RING_T@3(RING) JACK12.SWITCH_B@1(SWITCH) JACK12.SWITCH_T@3(SWITCH) Q1.E Q2.E Q3.E Q6.E Q7.E R17.P$1(E) R44.P$1(E) R68.P$1(E) ; also sheet 1,2,4
KNOB_BALANCE_1: C24.1 R17.P$2(S) ; also sheet 1
KNOB_BALANCE_2: C4.1 R68.P$2(S) ; also sheet 1
KNOB_TEMPO: C41.1 R44.P$2(S) ; also sheet 1
N$2: Q3.B R4.2
N$3: JACK2.TIP_B@1(TIP) JACK2.TIP_T@3(TIP) R16.2
N$4: C15.1 IC4.9(M:-IN) R12.2 R15.1 R16.1
N$6: Q6.B R1.2
N$8: JACK3.TIP_B@1(TIP) JACK3.TIP_T@3(TIP) R1.1
N$11: Q7.B R3.2
N$12: JACK6.TIP_B@1(TIP) JACK6.TIP_T@3(TIP) R3.1
N$15: Q1.B R18.2
N$16: JACK4.TIP_B@1(TIP) JACK4.TIP_T@3(TIP) R18.1
N$17: JACK12.TIP_B@1(TIP) JACK12.TIP_T@3(TIP) R4.1
N$33: JACK1.TIP_B@1(TIP) JACK1.TIP_T@3(TIP) R14.2
N$34: C16.1 IC4.6(L:-IN) R14.1 R22.2 R28.1
N$44: Q2.B R72.2
N$45: JACK5.TIP_B@1(TIP) JACK5.TIP_T@3(TIP) R72.1
N$65: IC4.13(N:-IN) IC4.14(N:OUT)
N$66: IC4.1(K:OUT) IC4.2(K:-IN)
REF_-5V [heavypower]: R15.2 R28.2 ; also sheet 4
RESET_PATTERN: Q1.C R20.1 ; also sheet 1
START_1: Q6.C R2.1 ; also sheet 1
START_2: Q7.C R11.1 ; also sheet 1
Unconnected: JACK1.SECOND_B@1(SECOND) JACK1.SECOND_T@3(SECOND) JACK2.SECOND_B@1(SECOND) JACK2.SECOND_T@3(SECOND) JACK3.SECOND_B@1(SECOND) JACK3.SECOND_T@3(SECOND) JACK4.SECOND_B@1(SECOND) JACK4.SECOND_T@3(SECOND) JACK5.SECOND_B@1(SECOND) JACK5.SECOND_T@3(SECOND) JACK6.SECOND_B@1(SECOND) JACK6.SECOND_T@3(SECOND) JACK12.SECOND_B@1(SECOND) JACK12.SECOND_T@3(SECOND)

### Notes on the sheet
- -5.0 to 5.0 -> 3.3 -> 0.0
- -5.0 to 5.0 -> 3.3 -> 0.0

## Library data of the parts
C1 C2 C4 C7 C14 C17 C20 C24 C41-C46 = resistor:C-EU: CAPACITOR, European symbol; MF: MULTICOMP; MPN: MC0603F104Z160CT; OC_FARNELL: 1759017
C5 C23 C48 = EurorackModularParts:C-POLAR*; MF: AVX; MPN: TAJB106K020RNJ; OC_FARNELL: 197427
C6 = resistor:C-EU: CAPACITOR, European symbol; MF: AVX; MPN: 06035C104KAT2A; OC_FARNELL: 1301804
C8 C11 C38 C47 C49-C59 = OPL:C*
C15 C16 = OPL:C*; OC_FARNELL: unknown
D1 D2 = OPL:D*: DIODE; MF: VISHAY; MPN: US1G-E3/5AT; OC_FARNELL: 9551824
D3 = EurorackModularParts:LED*: LED; DESC: Clock Out
D6 = EurorackModularParts:LED*: LED; DESC: Reset
D7 = EurorackModularParts:LED*: LED; DESC: Rec 1
D8 = EurorackModularParts:LED*: LED; DESC: Rec 2
D9 = EurorackModularParts:LED*: LED; DESC: Clock
D18 = OPL:D*: DIODE
IC1 IC8 = 74xx-eu:74*165: 8-bit parallel load SHIFT REGISTER
IC2 = EurorackModularParts:TL074: OP AMP
IC3 = EurorackModularParts:NE5532: AUDIO AMPLIFIER
IC4 = EurorackModularParts:MCP6004; MF: MICROCHIP; MPN: MCP6004-I/SL.; OC_FARNELL: 1605572
IC5-IC7 = FarnellThings:74HC595BQ: 8-bit serial-in, serial or parallel-out shift register,QFN-16; MF: NXP; MPN: 74HC595BQ; OC_FARNELL: 2164850; OC_NEWARK: 43W8000; PACKAGE: QFN-16; SUPPLIER: NXP
J14 = EurorackModularParts:POWER_SIMPLE; OC_FARNELL: unknown
JACK1 = EurorackModularParts:AUDIO-JACK_SMALLSYMBOL: Switching Mono 3.5mm Audio Jack from Erthenvar.; DESC: Balance 1
JACK2 = EurorackModularParts:AUDIO-JACK_SMALLSYMBOL: Switching Mono 3.5mm Audio Jack from Erthenvar.; DESC: Balance 2
JACK3 = EurorackModularParts:AUDIO-JACK_SMALLSYMBOL: Switching Mono 3.5mm Audio Jack from Erthenvar.; DESC: Start 1
JACK4 = EurorackModularParts:AUDIO-JACK_SMALLSYMBOL: Switching Mono 3.5mm Audio Jack from Erthenvar.; DESC: Reset
JACK5 = EurorackModularParts:AUDIO-JACK_SMALLSYMBOL: Switching Mono 3.5mm Audio Jack from Erthenvar.; DESC: Sync
JACK6 = EurorackModularParts:AUDIO-JACK_SMALLSYMBOL: Switching Mono 3.5mm Audio Jack from Erthenvar.; DESC: Start 2
JACK7 = EurorackModularParts:AUDIO-JACK_SMALLSYMBOL: Switching Mono 3.5mm Audio Jack from Erthenvar.; DESC: In 1
JACK8 = EurorackModularParts:AUDIO-JACK_SMALLSYMBOL: Switching Mono 3.5mm Audio Jack from Erthenvar.; DESC: In 2
JACK9 = EurorackModularParts:AUDIO-JACK_SMALLSYMBOL: Switching Mono 3.5mm Audio Jack from Erthenvar.; DESC: Clock
JACK10 = EurorackModularParts:AUDIO-JACK_SMALLSYMBOL: Switching Mono 3.5mm Audio Jack from Erthenvar.; DESC: Out 1
JACK11 = EurorackModularParts:AUDIO-JACK_SMALLSYMBOL: Switching Mono 3.5mm Audio Jack from Erthenvar.; DESC: Out 2
JACK12 = EurorackModularParts:AUDIO-JACK_SMALLSYMBOL: Switching Mono 3.5mm Audio Jack from Erthenvar.; DESC: Arm 1
L1-L4 = OPL:L*
OUTLINE = EurorackModularParts:EURORACK_PCB; OC_FARNELL: unknown
Q1-Q3 Q5-Q7 = transistor:*-NPN-: NPN Transistror BF959 corrected 2008.03.06; MF: NXP; MPN: PMBT3904,215; OC_FARNELL: 2336795
R1-R16 R18-R43 R45-R61 R72-R74 R90-R96 = resistor:R-EU_: RESISTOR, European symbol; OC_FARNELL: unknown
R17 = EurorackModularParts:POT; DESC: Balance 1; OC_FARNELL: unknown
R44 = EurorackModularParts:POT; DESC: Tempo; OC_FARNELL: unknown
R62-R67 R69-R71 R75-R89 = resistor:R-EU_: RESISTOR, European symbol
R68 = EurorackModularParts:POT; DESC: Balance 2; OC_FARNELL: unknown
TP6 TP7 = testpad:PTR1: TEST PIN
U1 = FarnellThings:LM4040DIM3-5.0: IC, Precision Micropower Shunt Voltage Reference, 5V,SOT-23-3; MF: TEXAS INSTRUMENTS; MPN: LM4040DIM3-5.0; OC_FARNELL: 9778330; OC_NEWARK: 97K3489; PACKAGE: SOT-23-3; SUPPLIER: TEXAS INSTRUMENTS
U$1 U$11-U$13 U$23 U$24 U$28 U$31-U$44 = zephod-components:SWITCH_W_LED_PB6149L-X-102
U$5 = EurorackModularParts:BL9342
U$50 = EurorackModularParts:MCP6022
U$55 = FenixBase:MCUPLUGIN2

## Net classes
0 default: width 0.203 mm, clearance 0.178 mm
1 heavypower: width 0.305 mm
2 mediumpower: width 0.254 mm
3 groundplane: width 0.203 mm, clearance 0.203 mm
4 returnground: width 0.356 mm
5 reallyheav: width 0.762 mm